# Altium project waku-ctl-board.PrjPcb (part 1 of 5)
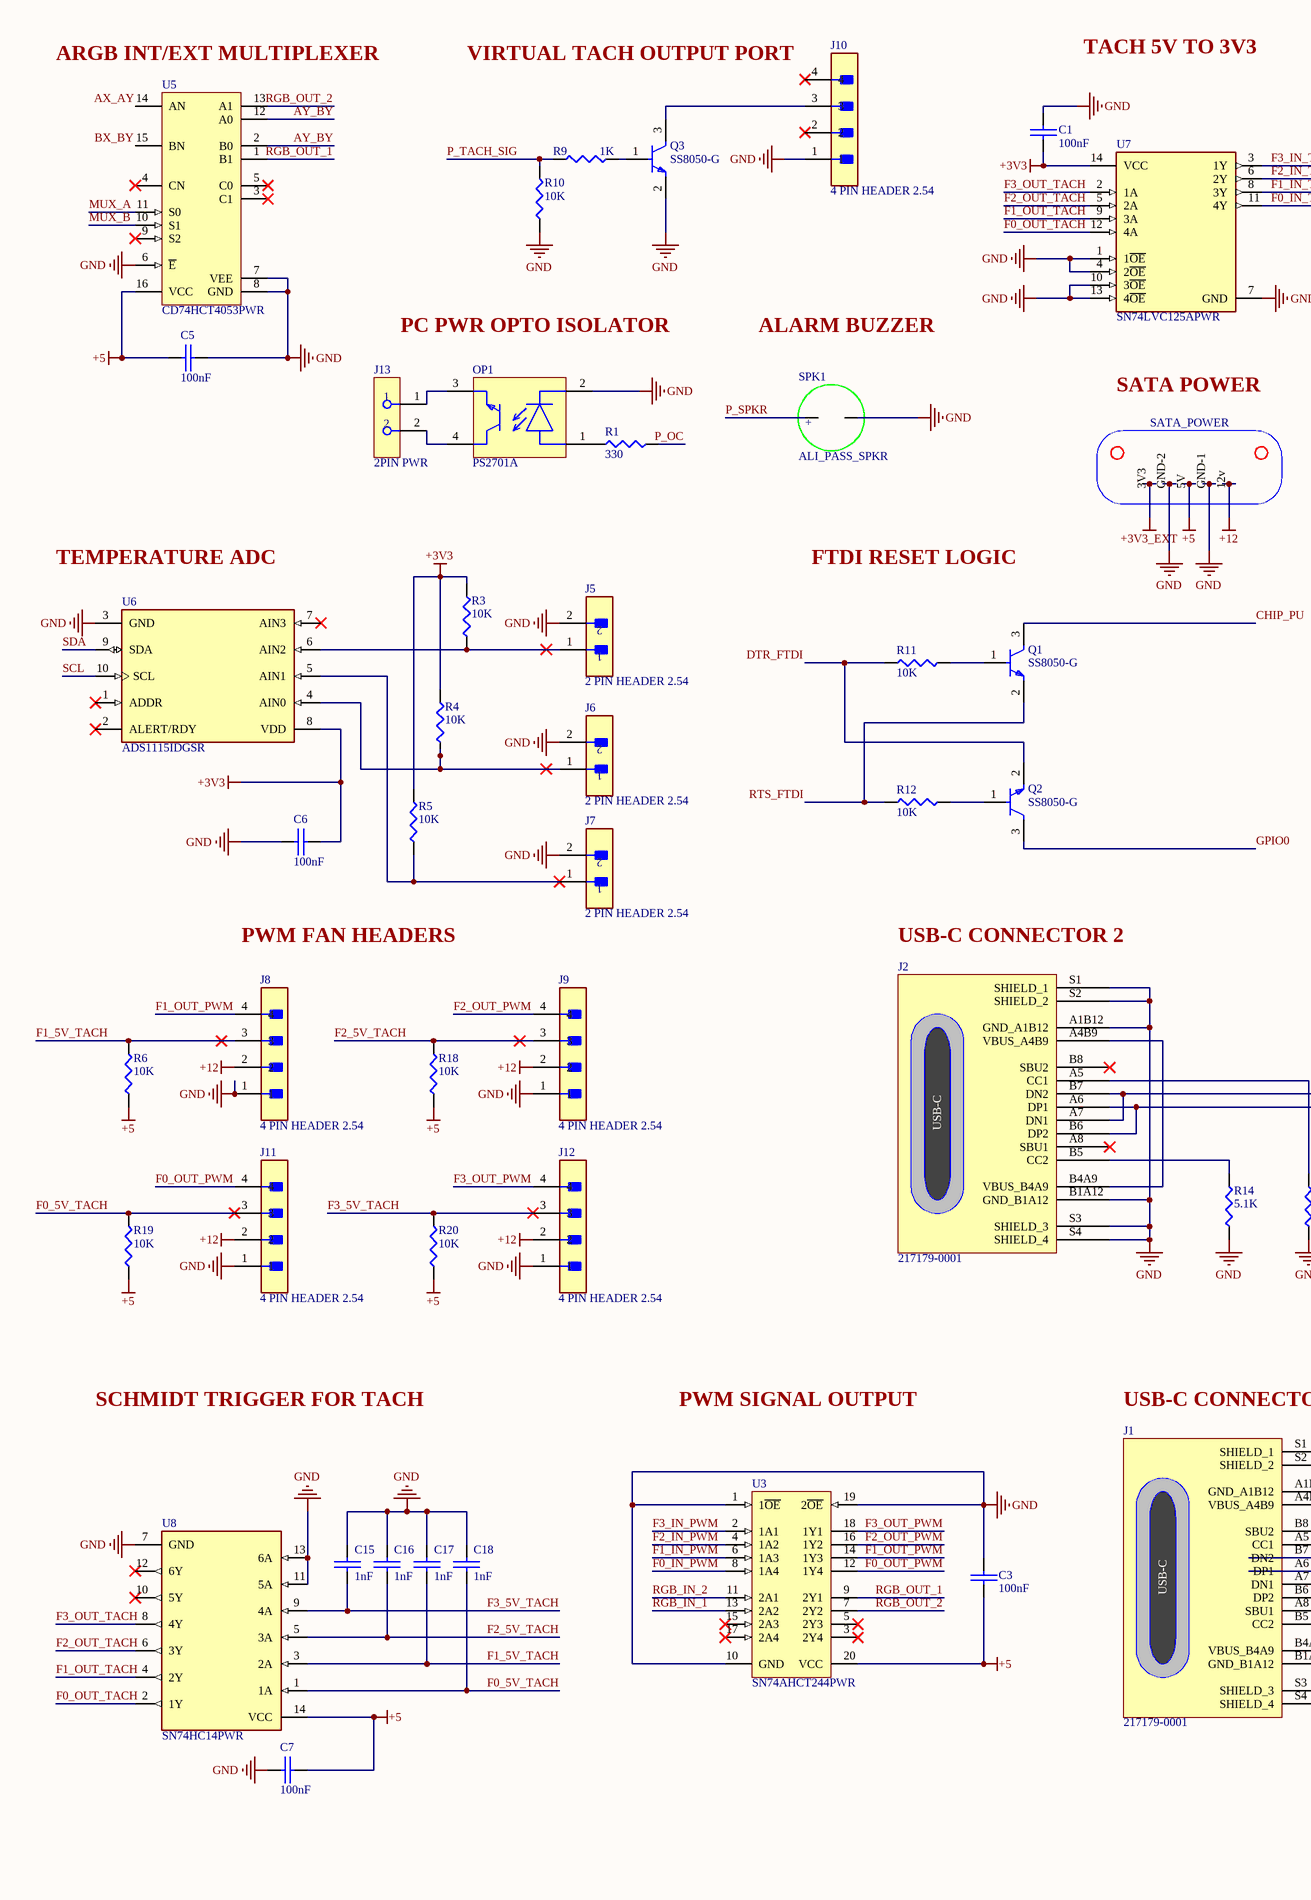
[diagram p0: waku-ctl.SchDoc, left]
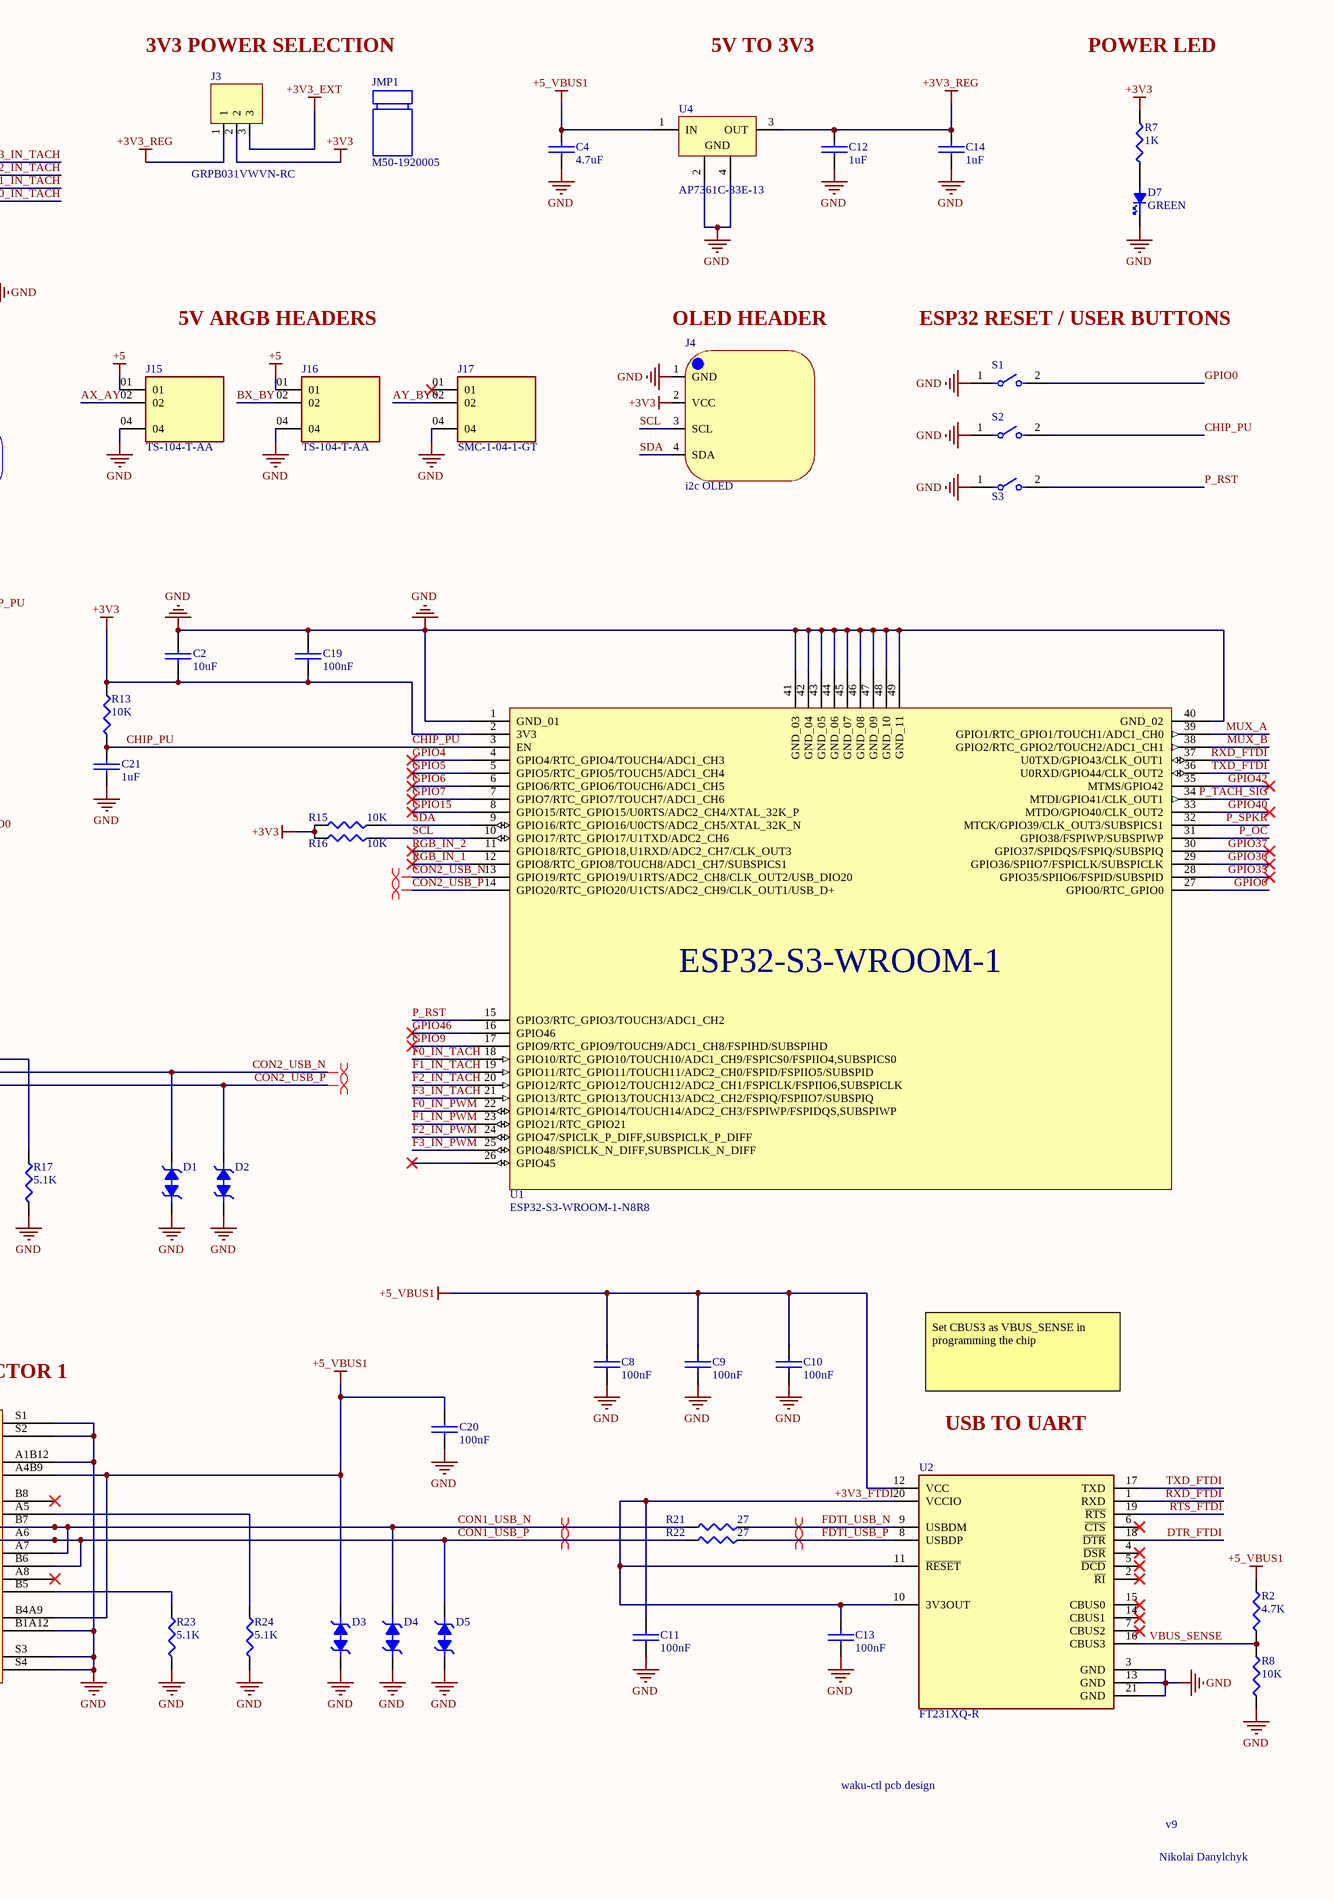
[diagram p1: waku-ctl.SchDoc, right]
1 sheet, 85 parts. Net scope: global (net labels, ports and power ports of the same name join across sheets).
Board file: waku-ctl.PcbDoc

## Sheet waku-ctl.SchDoc
size C; SheetNumber: 1; SheetTotal: 1

### Parts
C1  100nF  [SAM_SMD_CAP_CL_0603]
C2  10uF  [SAM_SMD_CAP_CL_0603]
C3  100nF  [SAM_SMD_CAP_CL_0603]
C4  4.7uF  [SAM_SMD_CAP_CL_0603]
C5  100nF  [SAM_SMD_CAP_CL_0603]
C6  100nF  [SAM_SMD_CAP_CL_0603]
C7  100nF  [SAM_SMD_CAP_CL_0603]
C8  100nF  [SAM_SMD_CAP_CL_0603]
C9  100nF  [SAM_SMD_CAP_CL_0603]
C10  100nF  [SAM_SMD_CAP_CL_0603]
C11  100nF  [SAM_SMD_CAP_CL_0603]
C12  1uF  [SAM_SMD_CAP_CL_0603]
C13  100nF  [SAM_SMD_CAP_CL_0603]
C14  1uF  [SAM_SMD_CAP_CL_0603]
C15  1nF  [SAM_SMD_CAP_CL_0603]
C16  1nF  [SAM_SMD_CAP_CL_0603]
C17  1nF  [SAM_SMD_CAP_CL_0603]
C18  1nF  [SAM_SMD_CAP_CL_0603]
C19  100nF  [SAM_SMD_CAP_CL_0603]
C20  100nF  [SAM_SMD_CAP_CL_0603]
C21  1uF  [SAM_SMD_CAP_CL_0603]
D1  SP3022-01ETG  [SP3022-01ETG]  (value not drawn)
D2  SP3022-01ETG  [SP3022-01ETG]  (value not drawn)
D3  SP3022-01ETG  [SP3022-01ETG]  (value not drawn)
D4  SP3022-01ETG  [SP3022-01ETG]  (value not drawn)
D5  SP3022-01ETG  [SP3022-01ETG]  (value not drawn)
D7  GREEN  [VLMG1500-GS08]
J1  217179-0001  [217179-0001]
J2  217179-0001  [217179-0001]
J3  GRPB031VWVN-RC  [GRPB031VWVN-RC]
J4  i2c OLED  [HS-HS96L03W2C03-OLED]
J5  2 PIN HEADER 2.54  [22-28-8020]
J6  2 PIN HEADER 2.54  [22-28-8020]
J7  2 PIN HEADER 2.54  [22-28-8020]
J8  4 PIN HEADER 2.54  [47053-1000]
J9  4 PIN HEADER 2.54  [47053-1000]
J10  4 PIN HEADER 2.54  [47053-1000]
J11  4 PIN HEADER 2.54  [47053-1000]
J12  4 PIN HEADER 2.54  [47053-1000]
J13  2PIN PWR  [SSQ-102-02-T-S-RA]
J15  TS-104-T-AA  [TS-104-T-AA]
J16  TS-104-T-AA  [TS-104-T-AA]
J17  SMC-1-04-1-GT  [SMC-1-04-1-GT]
JMP1  M50-1920005  (mechanical)
OP1  PS2701A  [PS2701A-1-F3-A]
Q1  SS8050-G  [SS8050-G]
Q2  SS8050-G  [SS8050-G]
Q3  SS8050-G  [SS8050-G]
R1  330  [YAG_SMD_RES_RC_0603]
R2  4.7K  [YAG_SMD_RES_RC_0603]
R3  10K  [YAG_SMD_RES_RC_0603]
R4  10K  [YAG_SMD_RES_RC_0603]
R5  10K  [YAG_SMD_RES_RC_0603]
R6  10K  [YAG_SMD_RES_RC_0603]
R7  1K  [YAG_SMD_RES_RC_0603]
R8  10K  [YAG_SMD_RES_RC_0603]
R9  1K  [YAG_SMD_RES_RC_0603]
R10  10K  [YAG_SMD_RES_RC_0603]
R11  10K  [YAG_SMD_RES_RC_0603]
R12  10K  [YAG_SMD_RES_RC_0603]
R13  10K  [YAG_SMD_RES_RC_0603]
R14  5.1K  [YAG_SMD_RES_RC_0603]
R15  10K  [YAG_SMD_RES_RC_0603]
R16  10K  [YAG_SMD_RES_RC_0603]
R17  5.1K  [YAG_SMD_RES_RC_0603]
R18  10K  [YAG_SMD_RES_RC_0603]
R19  10K  [YAG_SMD_RES_RC_0603]
R20  10K  [YAG_SMD_RES_RC_0603]
R21  27  [YAG_SMD_RES_RC_0603]
R22  27  [YAG_SMD_RES_RC_0603]
R23  5.1K  [YAG_SMD_RES_RC_0603]
R24  5.1K  [YAG_SMD_RES_RC_0603]
S1  PTS636SMG25JSMTRLFS  [PTS636SMG25JSMTRLFS]  (value not drawn)
S2  PTS636SMG25JSMTRLFS  [PTS636SMG25JSMTRLFS]  (value not drawn)
S3  PTS636SMG25JSMTRLFS  [PTS636SMG25JSMTRLFS]  (value not drawn)
SATA_POWER  SATA 15 pin power connector  [Sata_15pin_power]  (value not drawn)
SPK1  ALI_PASS_SPKR  [HC9042-16]
U1  ESP32-S3-WROOM-1-N8R8  [ESP32-S3-WROOM-1]
U2  FT231XQ-R  [FT231XQ-R]
U3  SN74AHCT244PWR  [SN74AHCT244PWR]
U4  AP7361C-33E-13  [AP7361C-33E-13]
U5  CD74HCT4053PWR  [CD74HCT4053PWR]
U6  ADS1115IDGSR  [ADS1115IDGSR]
U7  SN74LVC125APWR  [SN74LVC125APWR]
U8  SN74HC14PWR  [SN74HC14PWR]

### Nets
+3V3: C1.2 C2.1 C6.2 C19.2 J3.2 J4.2(VCC) R3.2 R4.2 R5.2 R7.2 R13.2 R15.1 R16.1 U1.2(3V3) U6.8(VDD) U7.14(VCC)
+3V3_EXT: J3.3 SATA_POWER.3V3
+3V3_REG: C12.2 C14.2 J3.1 U4.3(OUT)
+5: C3.1 C5.1 C7.2 J15.01 J16.01 R6.1 R18.1 R19.1 R20.1 SATA_POWER.5V U3.20(VCC) U5.16(VCC) U8.14(VCC)
+5_VBUS1: C4.2 C8.2 C9.2 C10.2 C20.2 D3.2 J1.A4B9(VBUS_A4B9) J1.B4A9(VBUS_B4A9) R2.2 U2.12(VCC) U4.1(IN)
+12: J8.2 J9.2 J11.2 J12.2 SATA_POWER.12v
GND: C1.1 C2.2 C3.2 C4.1 C5.2 C6.1 C7.1 C8.1 C9.1 C10.1 C11.1 C12.1 C13.1 C14.1 C15.2 C16.2 C17.2 C18.2 C19.1 C20.1 C21.1 D1.1 D2.1 D3.1 D4.1 D5.1 D7.1 J1.A1B12(GND_A1B12) J1.B1A12(GND_B1A12) J1.S1(SHIELD_1) J1.S2(SHIELD_2) J1.S3(SHIELD_3) J1.S4(SHIELD_4) J2.A1B12(GND_A1B12) J2.B1A12(GND_B1A12) J2.S1(SHIELD_1) J2.S2(SHIELD_2) J2.S3(SHIELD_3) J2.S4(SHIELD_4) J4.1(GND) J5.2 J6.2 J7.2 J8.1 J9.1 J10.1 J11.1 J12.1 J15.04 J16.04 J17.04 OP1.2(CATHODE) Q3.2(E) R8.1 R10.1 R14.1 R17.1 R23.1 R24.1 S1.1 S2.1 S3.1 SATA_POWER.GND-1 SATA_POWER.GND-2 SPK1.2 U1.1(GND_01) U1.40(GND_02) U1.41(GND_03) U1.42(GND_04) U1.43(GND_05) U1.44(GND_06) U1.45(GND_07) U1.46(GND_08) U1.47(GND_09) U1.48(GND_10) U1.49(GND_11) U2.3(GND) U2.13(GND) U2.21(GND) U3.1(1~{OE}) U3.10(GND) U3.19(2~{OE}) U4.2(GND) U4.4(GND) U5.6(~{E}) U5.7(VEE) U5.8(GND) U6.3(GND) U7.1(1~{OE}) U7.4(2~{OE}) U7.7(GND) U7.10(3~{OE}) U7.13(4~{OE}) U8.7(GND) U8.11(5A) U8.13(6A)
+3V3_FTDI: C11.2 C13.2 U2.10(3V3OUT) U2.11(~{RESET}) U2.20(VCCIO)
AX_AY: J15.02 U5.14(AN)
AY_BY: J17.02 U5.2(B0) U5.12(A0)
BX_BY: J16.02 U5.15(BN)
CHIP_PU: C21.2 Q1.3(C) R13.1 S2.2 U1.3(EN)
CON1_USB_N: D4.2 J1.A7(DN1) J1.B7(DN2) R21.1
CON1_USB_P: D5.2 J1.A6(DP1) J1.B6(DP2) R22.1
CON2_USB_N: D1.2 J2.A7(DN1) J2.B7(DN2) U1.13(GPIO19/RTC_GPIO19/U1RTS/ADC2_CH8/CLK_OUT2/USB_DIO20)
CON2_USB_P: D2.2 J2.A6(DP1) J2.B6(DP2) U1.14(GPIO20/RTC_GPIO20/U1CTS/ADC2_CH9/CLK_OUT1/USB_D+)
DTR_FTDI: Q2.2(E) R11.2 U2.18(~{DTR})
F0_5V_TACH: C18.1 J11.3 R19.2 U8.1(1A)
F0_IN_PWM: U1.22(GPIO14/RTC_GPIO14/TOUCH14/ADC2_CH3/FSPIWP/FSPIDQS,SUBSPIWP) U3.8(1A4)
F0_IN_TACH: U1.18(GPIO10/RTC_GPIO10/TOUCH10/ADC1_CH9/FSPICS0/FSPIIO4,SUBSPICS0) U7.11(4Y)
F0_OUT_PWM: J11.4 U3.12(1Y4)
F0_OUT_TACH: U7.12(4A) U8.2(1Y)
F1_5V_TACH: C17.1 J8.3 R6.2 U8.3(2A)
F1_IN_PWM: U1.23(GPIO21/RTC_GPIO21) U3.6(1A3)
F1_IN_TACH: U1.19(GPIO11/RTC_GPIO11/TOUCH11/ADC2_CH0/FSPID/FSPIIO5/SUBSPID) U7.8(3Y)
F1_OUT_PWM: J8.4 U3.14(1Y3)
F1_OUT_TACH: U7.9(3A) U8.4(2Y)
F2_5V_TACH: C16.1 J9.3 R18.2 U8.5(3A)
F2_IN_PWM: U1.24(GPIO47/SPICLK_P_DIFF,SUBSPICLK_P_DIFF) U3.4(1A2)
F2_IN_TACH: U1.20(GPIO12/RTC_GPIO12/TOUCH12/ADC2_CH1/FSPICLK/FSPIIO6,SUBSPICLK) U7.6(2Y)
F2_OUT_PWM: J9.4 U3.16(1Y2)
F2_OUT_TACH: U7.5(2A) U8.6(3Y)
F3_5V_TACH: C15.1 J12.3 R20.2 U8.9(4A)
F3_IN_PWM: U1.25(GPIO48/SPICLK_N_DIFF,SUBSPICLK_N_DIFF) U3.2(1A1)
F3_IN_TACH: U1.21(GPIO13/RTC_GPIO13/TOUCH13/ADC2_CH2/FSPIQ/FSPIIO7/SUBSPIQ) U7.3(1Y)
F3_OUT_PWM: J12.4 U3.18(1Y1)
F3_OUT_TACH: U7.2(1A) U8.8(4Y)
FDTI_USB_N: R21.2 U2.9(USBDM)
FDTI_USB_P: R22.2 U2.8(USBDP)
GPIO0: Q2.3(C) S1.2 U1.27(GPIO0/RTC_GPIO0)
GPIO4: U1.4(GPIO4/RTC_GPIO4/TOUCH4/ADC1_CH3)
GPIO5: U1.5(GPIO5/RTC_GPIO5/TOUCH5/ADC1_CH4)
GPIO6: U1.6(GPIO6/RTC_GPIO6/TOUCH6/ADC1_CH5)
GPIO7: U1.7(GPIO7/RTC_GPIO7/TOUCH7/ADC1_CH6)
GPIO9: U1.17(GPIO9/RTC_GPIO9/TOUCH9/ADC1_CH8/FSPIHD/SUBSPIHD)
GPIO15: U1.8(GPIO15/RTC_GPIO15/U0RTS/ADC2_CH4/XTAL_32K_P)
GPIO35: U1.28(GPIO35/SPIIO6/FSPID/SUBSPID)
GPIO36: U1.29(GPIO36/SPIIO7/FSPICLK/SUBSPICLK)
GPIO37: U1.30(GPIO37/SPIDQS/FSPIQ/SUBSPIQ)
GPIO40: U1.33(MTDO/GPIO40/CLK_OUT2)
GPIO42: U1.35(MTMS/GPIO42)
GPIO46: U1.16(GPIO46)
MUX_A: U1.39(GPIO1/RTC_GPIO1/TOUCH1/ADC1_CH0) U5.11(S0)
MUX_B: U1.38(GPIO2/RTC_GPIO2/TOUCH2/ADC1_CH1) U5.10(S1)
P_OC: R1.2 U1.31(GPIO38/FSPIWP/SUBSPIWP)
P_RST: S3.2 U1.15(GPIO3/RTC_GPIO3/TOUCH3/ADC1_CH2)
P_SPKR: SPK1.1 U1.32(MTCK/GPIO39/CLK_OUT3/SUBSPICS1)
P_TACH_SIG: R9.1 R10.2 U1.34(MTDI/GPIO41/CLK_OUT1)
RGB_IN_1: U1.12(GPIO8/RTC_GPIO8/TOUCH8/ADC1_CH7/SUBSPICS1) U3.13(2A2)
RGB_IN_2: U1.11(GPIO18/RTC_GPIO18,U1RXD/ADC2_CH7/CLK_OUT3) U3.11(2A1)
RGB_OUT_1: U3.9(2Y1) U5.1(B1)
RGB_OUT_2: U3.7(2Y2) U5.13(A1)
RTS_FTDI: Q1.2(E) R12.2 U2.19(~{RTS})
RXD_FTDI: U1.37(U0TXD/GPIO43/CLK_OUT1) U2.1(RXD)
SCL: J4.3(SCL) R16.2 U1.10(GPIO17/RTC_GPIO17/U1TXD/ADC2_CH6) U6.10(SCL)
SDA: J4.4(SDA) R15.2 U1.9(GPIO16/RTC_GPIO16/U0CTS/ADC2_CH5/XTAL_32K_N) U6.9(SDA)
TXD_FTDI: U1.36(U0RXD/GPIO44/CLK_OUT2) U2.17(TXD)
VBUS_SENSE: R2.1 R8.2 U2.16(CBUS3)
NetD7_2: D7.2 R7.1
NetJ1_A5: J1.A5(CC1) R24.2
NetJ1_B5: J1.B5(CC2) R23.2
NetJ2_A4B9: J2.A4B9(VBUS_A4B9) J2.B4A9(VBUS_B4A9)
NetJ2_A5: J2.A5(CC1) R17.2
NetJ2_B5: J2.B5(CC2) R14.2
NetJ5_1: J5.1 R3.1 U6.6(AIN2)
NetJ6_1: J6.1 R4.1 U6.4(AIN0)
NetJ7_1: J7.1 R5.1 U6.5(AIN1)
NetJ10_3: J10.3 Q3.3(C)
NetJ13_1: J13.1 OP1.3(EMITTER)
NetJ13_2: J13.2 OP1.4(COLLECTOR)
NetOP1_1: OP1.1(ANODE) R1.1
NetQ1_1: Q1.1(B) R11.1
NetQ2_1: Q2.1(B) R12.1
NetQ3_1: Q3.1(B) R9.2

Not connected (* = marked no-connect by the designer): J1 A8(SBU1)* B8(SBU2)*; J2 A8(SBU1)* B8(SBU2)*; J10 2* 4*; J17 01*; U1 26(GPIO45)*; U2 2(~{RI})* 4(~{DSR})* 5(~{DCD})* 6(~{CTS})* 7(CBUS2)* 14(CBUS1)* 15(CBUS0)*; U3 3(2Y4)* 5(2Y3)* 15(2A3)* 17(2A4)*; U5 3(C1)* 4(CN)* 5(C0)* 9(S2)*; U6 1(ADDR)* 2(ALERT/RDY)* 7(AIN3)*; U8 10(5Y)* 12(6Y)*

### Layout directives
differential pair; differential pair class DIFF90: CON1_USB_N, CON1_USB_P, CON2_USB_N, CON2_USB_P, FDTI_USB_N, FDTI_USB_P

### Notes on the sheet
- (near U5) ARGB INT/EXT MULTIPLEXER
- VIRTUAL TACH OUTPUT PORT
- TACH 5V TO 3V3
- 3V3 POWER SELECTION
- 5V TO 3V3
- POWER LED
- PC PWR OPTO ISOLATOR
- ALARM BUZZER
- 5V ARGB HEADERS
- (near J4) OLED HEADER
- ESP32 RESET / USER BUTTONS
- SATA POWER
- TEMPERATURE ADC
- FTDI RESET LOGIC
- PWM FAN HEADERS
- (near J2) USB-C CONNECTOR 2
- SCHMIDT TRIGGER FOR TACH
- PWM SIGNAL OUTPUT
- (near J1) USB-C CONNECTOR 1
- Set CBUS3 as VBUS_SENSE in programming the chip
- USB TO UART
- waku-ctl pcb design
- Nikolai Danylchyk
- v9
- (in symbol 217179-0001) USB-C
- (in symbol ESP32-S3-WROOM-1-N8R8) ESP32-S3-WROOM-1
- (in symbol HC9042-16) +